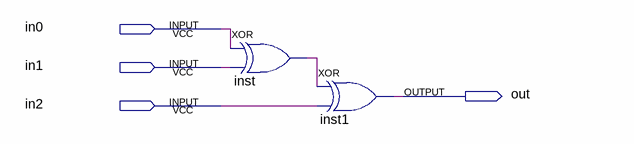
[diagram p0: schematic sheet]
// Quartus schematic xor3.bdf as structural Verilog: 2 symbols, 4 pins
module xor3 (
  input  in0,
  input  in1,
  input  in2,
  output out
);

  wire inst_out;

  xor inst (inst_out, in0, in1);
  xor inst1 (out, inst_out, in2);
endmodule
